# EAGLE design HandlesRegenerated (EAGLE 7.5.0)
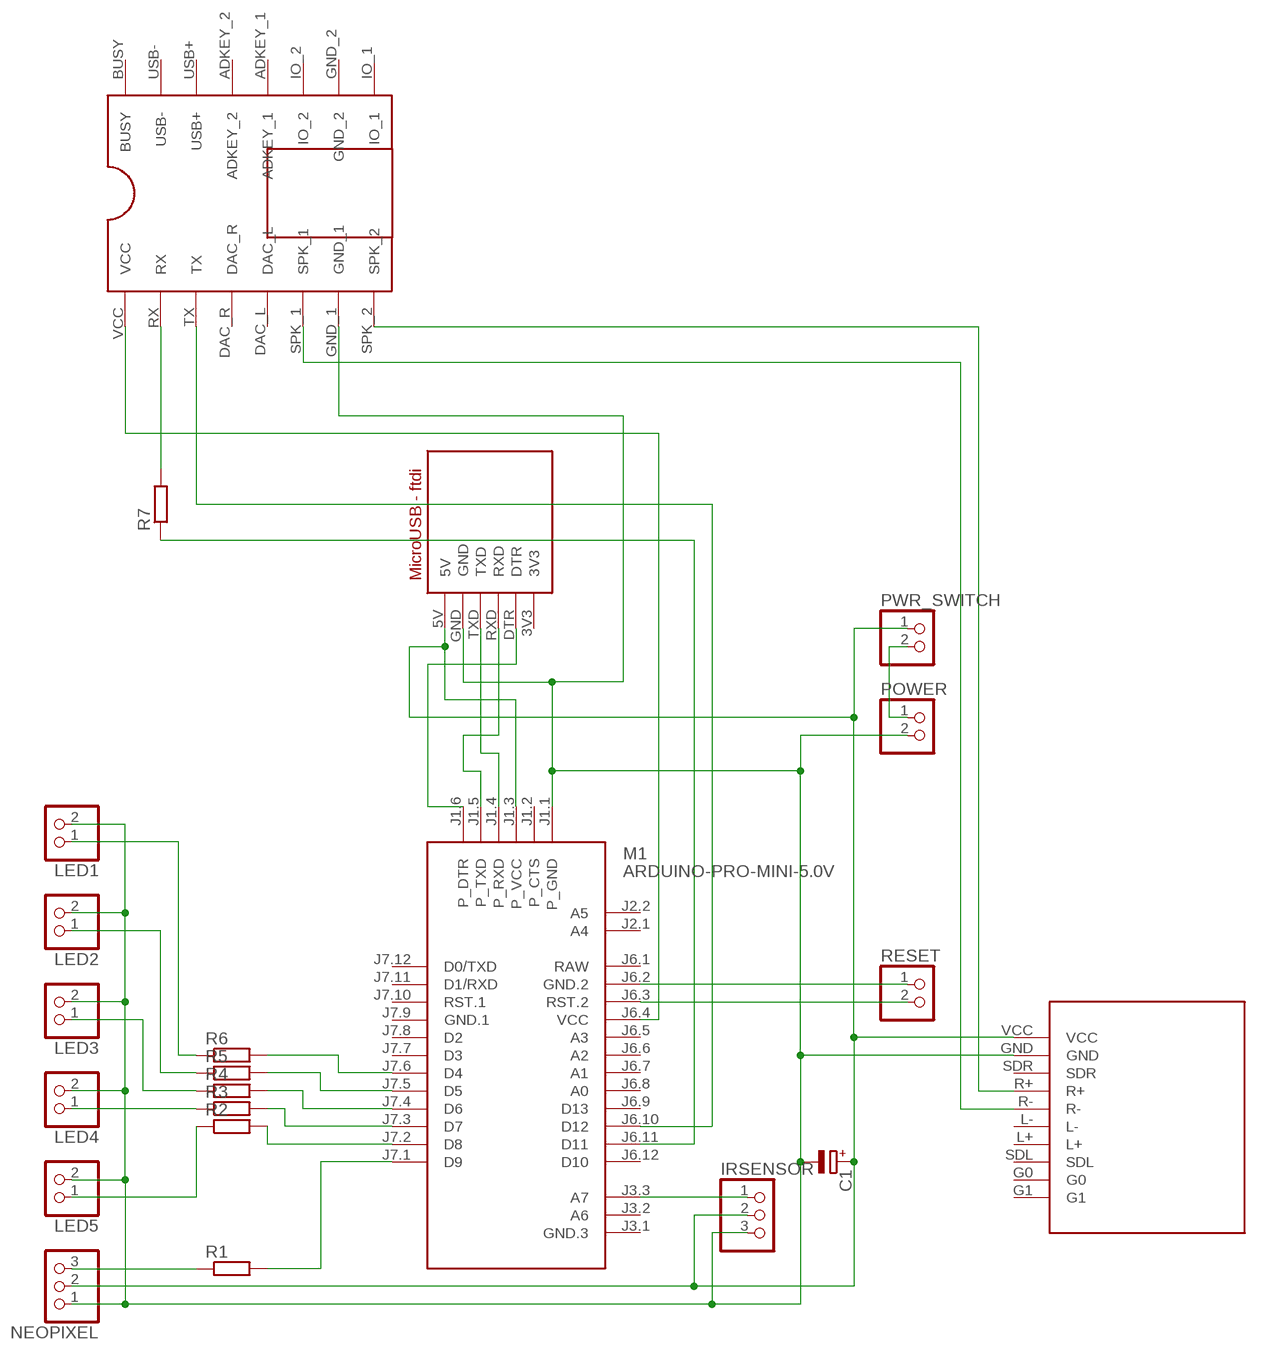
[diagram p0: schematic, sheet 1]

## Parts
C1  CPOL-EUE2,5-6E  [E2,5-6E]
IRSENSOR  PINHD-1X3  [1X03]
LED1  PINHD-1X2  [1X02]
LED2  PINHD-1X2  [1X02]
LED3  PINHD-1X2  [1X02]
LED4  PINHD-1X2  [1X02]
LED5  PINHD-1X2  [1X02]
M1  ARDUINO-PRO-MINI-5.0V  [ARDUINO-PRO-MINI]
NEOPIXEL  PINHD-1X3  [1X03]
POWER  PINHD-1X2  [1X02]
PWR_SWITCH  PINHD-1X2  [1X02]
R1  R-EU_0204/7  [0204/7]
R2  R-EU_0204/7  [0204/7]
R3  R-EU_0204/7  [0204/7]
R4  R-EU_0204/7  [0204/7]
R5  R-EU_0204/7  [0204/7]
R6  R-EU_0204/7  [0204/7]
R7  R-EU_0207/7  [0207/7]
RESET  PINHD-1X2  [1X02]
U$1  MICRO-USB-DEV  [MICRO-USB-PAC]
U$2  STEREO-AUDIO-AMP-DEV  [STEREO-AUDIO-AMP-PAC]
U$3  DPLAYER-MINI-DEV  [DPLAYER-MINI-PAC]

## Nets
N$1: M1.J7.1(D9) R1.2
N$2: NEOPIXEL.3 R1.1
N$3: POWER.1 PWR_SWITCH.2
N$4: U$2.R+ U$3.SPK_2
N$5: M1.J1.4(P_RXD) U$1.TXD
N$7: M1.J1.5(P_TXD) U$1.RXD
N$8: M1.J7.2(D8) R2.2
N$9: M1.J7.3(D7) R3.2
N$10: M1.J7.4(D6) R4.2
N$11: M1.J7.5(D5) R5.2
N$12: M1.J7.6(D4) R6.2
N$13: LED5.1 R2.1
N$14: LED1.1 R6.1
N$15: LED2.1 R5.1
N$16: LED3.1 R4.1
N$17: LED4.1 R3.1
N$18: C1.- IRSENSOR.3 LED1.2 LED2.2 LED3.2 LED4.2 LED5.2 M1.J1.1(P_GND) NEOPIXEL.1 POWER.2 U$1.GND U$2.GND U$3.GND_1
N$19: M1.J6.4(VCC) U$3.VCC
N$20: M1.J6.2(GND.2) RESET.1
N$21: M1.J6.3(RST.2) RESET.2
N$22: U$2.R- U$3.SPK_1
N$23: R7.2 U$3.RX
N$24: M1.J6.11(D11) R7.1
N$25: M1.J6.10(D12) U$3.TX
N$26: IRSENSOR.1 M1.J3.3(A7)
N$27: M1.J1.6(P_DTR) U$1.DTR
N$28: C1.+ IRSENSOR.2 M1.J1.3(P_VCC) NEOPIXEL.2 PWR_SWITCH.1 U$1.5V U$2.VCC
Unconnected: M1.J1.2(P_CTS) M1.J2.1(A4) M1.J2.2(A5) M1.J3.1(GND.3) M1.J3.2(A6) M1.J6.5(A3) M1.J6.6(A2) M1.J6.7(A1) M1.J6.8(A0) M1.J6.9(D13) M1.J6.12(D10) M1.J7.7(D3) M1.J7.8(D2) M1.J7.10(RST.1) M1.J7.11(D1/RXD) M1.J7.12(D0/TXD) U$2.L+ U$2.L- U$2.SDL U$2.SDR U$3.ADKEY_1 U$3.ADKEY_2 U$3.BUSY U$3.DAC_L U$3.DAC_R U$3.IO_1 U$3.IO_2 U$3.USB+ U$3.USB-

## Power pins joined to a net without a drawn wire
3V3: U$1.3V3
G0: U$2.G0
G1: U$2.G1
GND.1: M1.J7.9(GND.1)
GND_2: U$3.GND_2
RAW: M1.J6.1(RAW)

## Library data of the parts
C1 = rcl:CPOL-EU: POLARIZED CAPACITOR, European symbol
IRSENSOR NEOPIXEL = pinhead:PINHD-1X3: PIN HEADER
LED1-LED5 POWER PWR_SWITCH RESET = pinhead:PINHD-1X2: PIN HEADER
M1 = diy-modules:ARDUINO-PRO-MINI-*: Arduino Pro Mini
R1-R6 = rcl:R-EU_: RESISTOR, European symbol
R7 = resistor:R-EU_: RESISTOR, European symbol
U$1 = Dr_Burrows_library:MICRO-USB-DEV: MicroUSB FTDI Programmer
U$2 = Dr_Burrows_library:STEREO-AUDIO-AMP-DEV: 2 Channel Audio Amp Module
U$3 = Dr_Burrows_library:DPLAYER-MINI-DEV

## Board
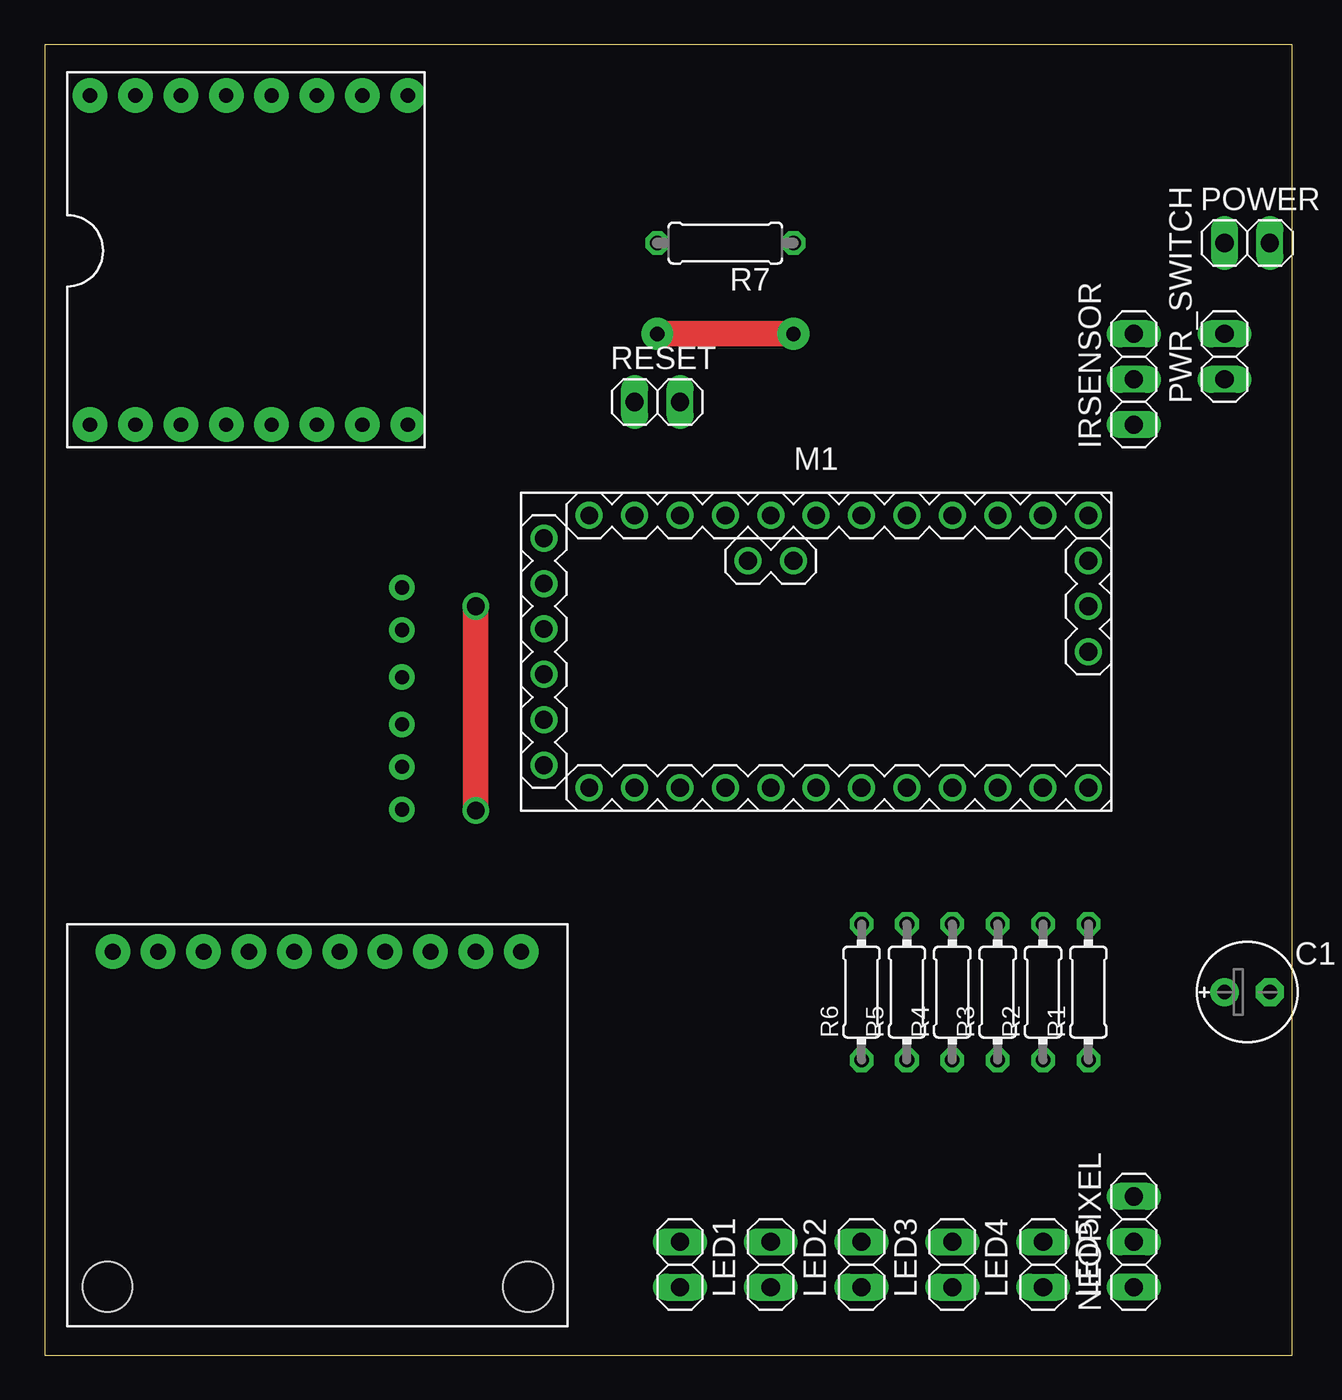
[diagram p1: board, top side]
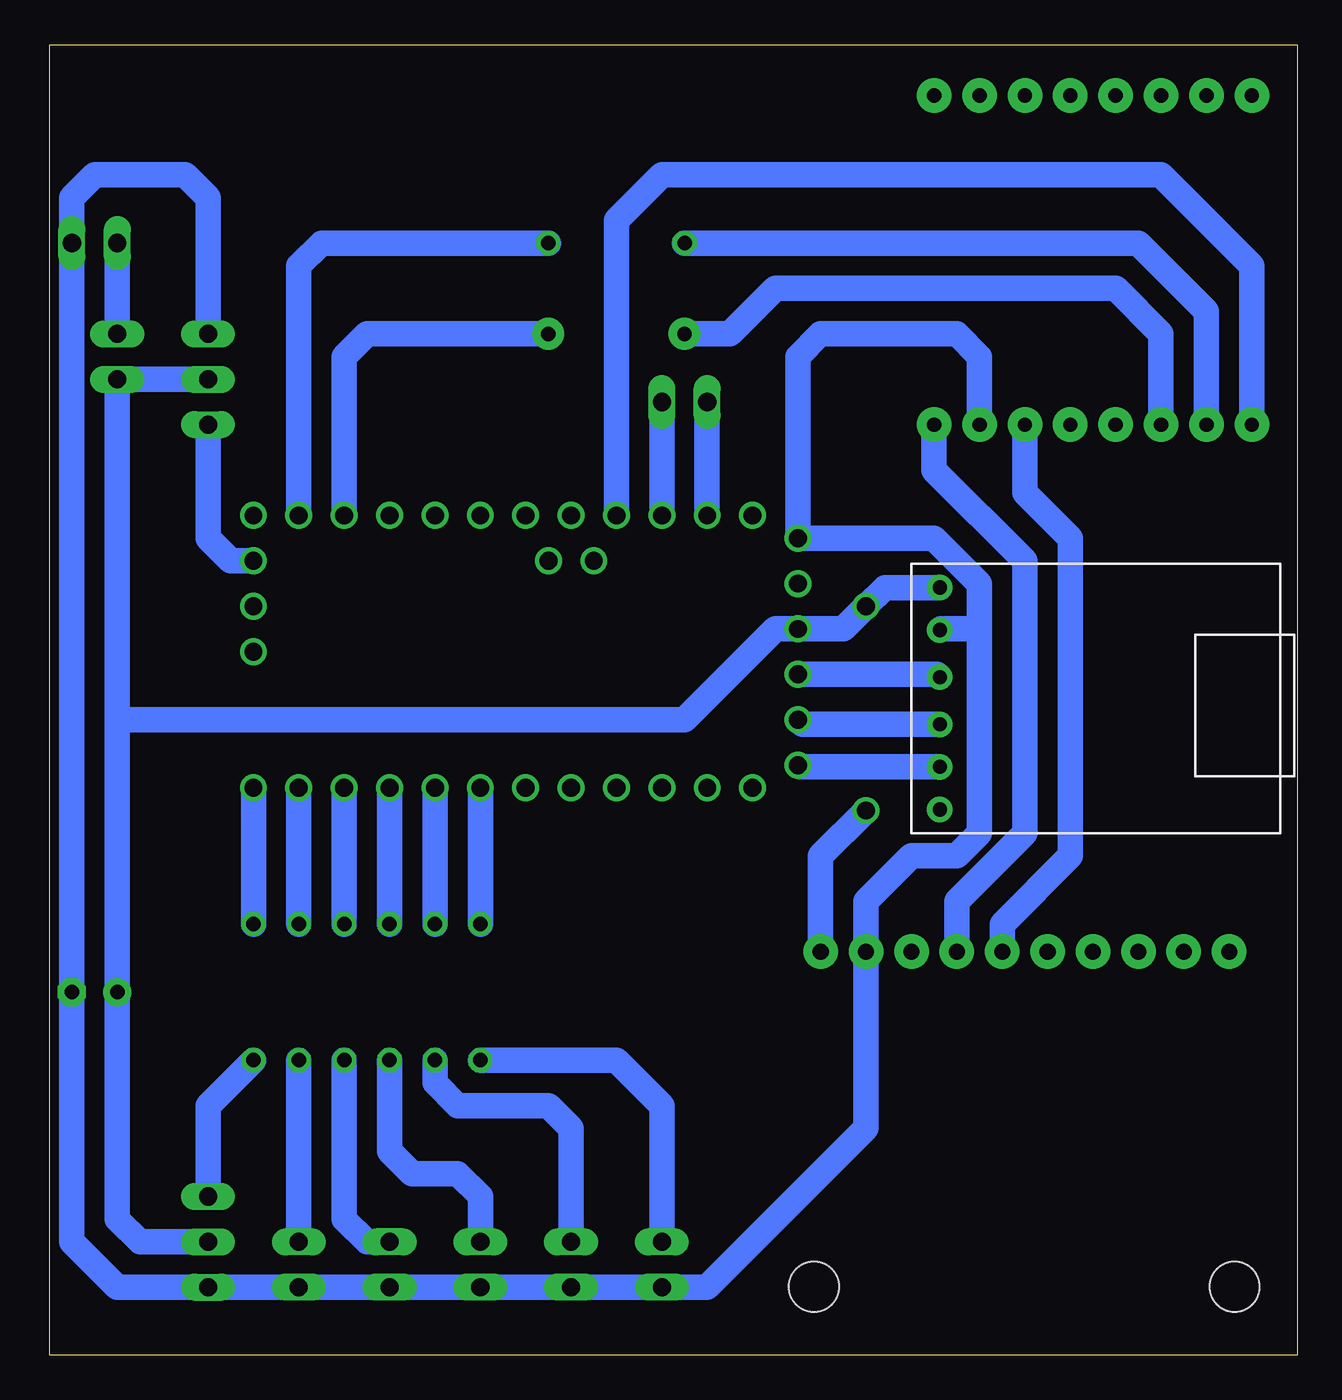
[diagram p2: board, bottom side, seen from below]

Size 69.83 x 73.33 mm. Coordinates in mm from the lower left corner, seen from the top.
Outline: 0,0 69.83,0 69.83,73.33 0,73.33 0,0
Copper layers (1*16): Top 0.035mm / dielectric 1.5mm / Bottom 0.035mm
Design rules "default *": minimum track width 10mil, minimum drill 24mil, track to track 8mil, track to pad 8mil, pad to pad 8mil, via to via 8mil, smd to smd 8mil, copper to edge 40mil, drill to drill 8mil, minimum pad ring 10mil, minimum via ring 8mil, stop-mask expansion 4mil, vias tented up to drill 0mil, thermal gap 10mil

### Footprints (pad centres in the part's own frame; a part is rotated, then mirrored left to right if it is on the bottom)
E2,5-6E = drill 0.813 pad 1.575: + -1.27,0 | drill 0.813 pad 1.575 octagon: - 1.27,0
1X03 = drill 1.016 long: 1 -2.54,0; 2 0,0; 3 2.54,0
1X02 = drill 1.016 long: 1 -1.27,0; 2 1.27,0
ARDUINO-PRO-MINI = drill 1: J1.1 -15.24,6.35; J1.2 -15.24,3.81; J1.3 -15.24,1.27; J1.4 -15.24,-1.27; J1.5 -15.24,-3.81; J1.6 -15.24,-6.35; J2.1 -1.27,5.08; J2.2 -3.81,5.08; J3.1 15.24,0; J3.2 15.24,2.54; J3.3 15.24,5.08; J6.1 -12.7,7.62; J6.2 -10.16,7.62; J6.3 -7.62,7.62; J6.4 -5.08,7.62; J6.5 -2.54,7.62; J6.6 0,7.62; J6.7 2.54,7.62; J6.8 5.08,7.62; J6.9 7.62,7.62; J6.10 10.16,7.62; J6.11 12.7,7.62; J6.12 15.24,7.62; J7.1 15.24,-7.62; J7.2 12.7,-7.62; J7.3 10.16,-7.62; J7.4 7.62,-7.62; J7.5 5.08,-7.62; J7.6 2.54,-7.62; J7.7 0,-7.62; J7.8 -2.54,-7.62; J7.9 -5.08,-7.62; J7.10 -7.62,-7.62; J7.11 -10.16,-7.62; J7.12 -12.7,-7.62
0204/7 = drill 0.813 octagon: 1 -3.81,0; 2 3.81,0
0207/7 = drill 0.813 octagon: 1 -3.81,0; 2 3.81,0
MICRO-USB-PAC = drill 0.8 pad 1.422: 3V3 1.587,1.333; 5V 1.587,13.748; DTR 1.587,3.715; GND 1.587,11.367; RXD 1.587,6.096; TXD 1.587,8.731
STEREO-AUDIO-AMP-PAC = drill 0.9 pad 1.93: G0 1.54,5.08; G1 1.54,2.54; GND 1.54,22.86; L+ 1.54,10.16; L- 1.54,12.7; R+ 1.54,17.78; R- 1.54,15.24; SDL 1.54,7.62; SDR 1.54,20.32; VCC 1.54,25.4 | hole 2.8: 20.3,25.78; 20.3,2.24
DPLAYER-MINI-PAC = drill 0.8 pad 1.93: ADKEY_1 11.43,19.685; ADKEY_2 8.89,19.685; BUSY 1.27,19.685; DAC_L 11.43,1.27; DAC_R 8.89,1.27; GND_1 16.51,1.27; GND_2 16.51,19.685; IO_1 19.05,19.685; IO_2 13.97,19.685; RX 3.81,1.27; SPK_1 13.97,1.27; SPK_2 19.05,1.27; TX 6.35,1.27; USB+ 6.35,19.685; USB- 3.81,19.685; VCC 1.27,1.27

### Placement (x,y rotation side)
C1  67.31,20.32 0 top
IRSENSOR  60.96,54.61 90 top
LED1  35.56,5.08 270 top
LED2  40.64,5.08 270 top
LED3  45.72,5.08 270 top
LED4  50.8,5.08 270 top
LED5  55.88,5.08 270 top
M1  43.18,39.37 0 top
NEOPIXEL  60.96,6.35 90 top
POWER  67.31,62.23 0 top
PWR_SWITCH  66.04,55.88 90 top
R1  58.42,20.32 90 top
R2  55.88,20.32 90 top
R3  53.34,20.32 90 top
R4  50.8,20.32 90 top
R5  48.26,20.32 90 top
R6  45.72,20.32 90 top
R7  38.1,62.23 180 top
RESET  34.29,53.34 0 top
U$1  21.59,29.21 0 bottom
U$2  1.27,24.13 270 top
U$3  1.27,50.8 0 top

### Tracks (layer width: path | path; a pad name or v marks a point on that pad's centre or on a via)
N$1
  Bottom 1.422: R1.2 M1.J7.1
N$2
  Bottom 1.422: R1.1 60.96,13.97 NEOPIXEL.3
N$3
  Bottom 1.422: POWER.1 PWR_SWITCH.2
N$4
  Bottom 1.422: U$3.SPK_2 20.32,49.53 15.24,44.45 15.24,29.21 19.05,25.4 U$2.R+
N$5
  Bottom 1.422: M1.J1.4 20.16,38.1 U$1.TXD
N$7
  Bottom 1.422: U$1.RXD 27.69,35.31 M1.J1.5
N$8
  Bottom 1.422: R2.2 M1.J7.2
N$9
  Bottom 1.422: R3.2 M1.J7.3
N$10
  Bottom 1.422: R4.2 M1.J7.4
N$11
  Bottom 1.422: R5.2 M1.J7.5
N$12
  Bottom 1.422: R6.2 M1.J7.6
N$13
  Bottom 1.422: R2.1 LED5.1
N$14
  Bottom 1.422: R6.1 38.1,16.51 35.56,13.97 LED1.1
N$15
  Bottom 1.422: R5.1 48.26,15.24 46.99,13.97 41.91,13.97 40.64,12.7 LED2.1
N$16
  Bottom 1.422: R4.1 50.8,11.43 49.53,10.16 46.99,10.16 45.72,8.89 LED3.1
N$17
  Bottom 1.422: R3.1 53.34,7.62 52.07,6.35 LED4.1
N$18
  Bottom 1.422: 17.78,40.64 17.78,43.18 20.32,45.72 M1.J1.1 27.94,55.88 26.67,57.15 19.05,57.15 17.78,55.88 U$3.GND_1 | 17.78,40.64 19.94,40.64 U$1.GND | 17.78,40.64 17.78,29.21 19.05,27.94 21.59,27.94 24.13,25.4 U$2.GND 24.13,12.7 33.02,3.81 LED1.2 LED2.2 LED3.2 LED4.2 LED5.2 NEOPIXEL.1 66.04,3.81 68.58,6.35 C1.- POWER.2 68.58,64.77 67.31,66.04 62.23,66.04 60.96,64.77 IRSENSOR.3
N$19
  Bottom 1.422: U$3.VCC 2.54,60.96 7.62,66.04 35.56,66.04 38.1,63.5 M1.J6.4
N$20
  Bottom 1.422: RESET.1 M1.J6.2
N$21
  Bottom 1.422: RESET.2 M1.J6.3
N$22
  Bottom 1.422: U$3.SPK_1 15.24,48.26 12.7,45.72 12.7,27.94 16.51,24.13 U$2.R-
N$23
  Bottom 1.422: U$3.RX 5.08,58.42 8.89,62.23 R7.2
N$24
  Bottom 1.422: R7.1 54.61,62.23 55.88,60.96 M1.J6.11
N$25  (via drill 0.8 pad 1.78)
  Top 1.422: v34.29,57.15 v41.91,57.15
  Bottom 1.422: U$3.TX 7.62,57.15 10.16,59.69 29.21,59.69 31.75,57.15 v34.29,57.15 | v41.91,57.15 52.07,57.15 53.34,55.88 M1.J6.10
N$26
  Bottom 1.422: IRSENSOR.1 60.96,45.72 59.69,44.45 M1.J3.3
N$27
  Bottom 1.422: U$1.DTR 27.84,32.92 M1.J1.6
N$28  (via drill 1 pad 0.81)
  Top 1.422: v24.13,30.48 v24.13,41.91
  Bottom 1.422: 66.04,35.56 PWR_SWITCH.1 IRSENSOR.2 | 66.04,35.56 C1.+ 66.04,7.62 64.77,6.35 NEOPIXEL.2 | 66.04,35.56 34.29,35.56 29.21,40.64 M1.J1.3 25.4,40.64 v24.13,41.91 23.08,42.96 U$1.5V | U$2.VCC 26.67,27.94 v24.13,30.48